# Altium project Infantry chassis pcb.PrjPcb
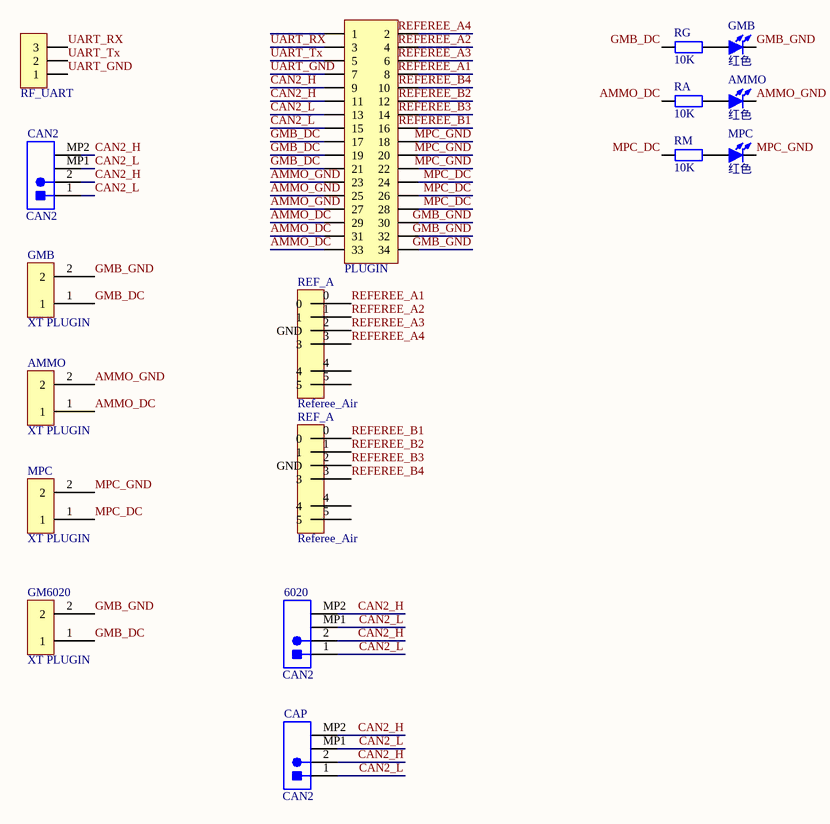
[diagram p0: schematic.SchDoc]
1 sheet, 17 parts. Net scope: global (net labels, ports and power ports of the same name join across sheets).
Board file: infantry chassis pcb.PcbDoc

## Sheet schematic.SchDoc
size A4

### Parts
(Parts that share a designator on the sheet are numbered #1, #2 ... from top to bottom, then left to right.)
6020  CAN2  [JST-BM02B-GHS-TBT_V]
AMMO#1  红色  [LED 0805G]
AMMO#2  XT PLUGIN  [XT30-M]
CAN2  CAN2  [JST-BM02B-GHS-TBT_V]
CAP  CAN2  [JST-BM02B-GHS-TBT_V]
GM6020  XT PLUGIN  [XT30-M]
GMB#1  红色  [LED 0805G]
GMB#2  XT PLUGIN  [XT30-M]
MPC#1  红色  [LED 0805G]
MPC#2  XT PLUGIN  [XT30-M]
PLUGIN  Header 2X11  [IDC2.54-LI-2x17P]  (value not drawn)
RA  10K  [R 0805_L]
REF_A#1  Referee_Air  [M8 Connector]
REF_A#2  Referee_Air  [M8 Connector]
RF_UART  HDR-1X3  [HDR2.54-LI-3P]  (value not drawn)
RG  10K  [R 0805_L]
RM  10K  [R 0805_L]

### Nets
AMMO_DC: AMMO#2.1 PLUGIN.29 PLUGIN.31 PLUGIN.33 RA.1
AMMO_GND: AMMO#1.2(K) AMMO#2.2 PLUGIN.23 PLUGIN.25 PLUGIN.27
CAN2_H: 6020.2 6020.MP2 CAN2.2 CAN2.MP2 CAP.2 CAP.MP2 PLUGIN.9 PLUGIN.11
CAN2_L: 6020.1 6020.MP1 CAN2.1 CAN2.MP1 CAP.1 CAP.MP1 PLUGIN.13 PLUGIN.15
GMB_DC: GM6020.1 GMB#2.1 PLUGIN.17 PLUGIN.19 PLUGIN.21 RG.1
GMB_GND: GM6020.2 GMB#1.2(K) GMB#2.2 PLUGIN.30 PLUGIN.32 PLUGIN.34
MPC_DC: MPC#2.1 PLUGIN.24 PLUGIN.26 PLUGIN.28 RM.1
MPC_GND: MPC#1.2(K) MPC#2.2 PLUGIN.18 PLUGIN.20 PLUGIN.22
REFEREE_A1: PLUGIN.8 REF_A#1.0
REFEREE_A2: PLUGIN.4 REF_A#1.1
REFEREE_A3: PLUGIN.6 REF_A#1.2(GND)
REFEREE_A4: PLUGIN.2 REF_A#1.3
REFEREE_B1: PLUGIN.16 REF_A#2.0
REFEREE_B2: PLUGIN.12 REF_A#2.1
REFEREE_B3: PLUGIN.14 REF_A#2.2(GND)
REFEREE_B4: PLUGIN.10 REF_A#2.3
UART_GND: PLUGIN.7 RF_UART.1
UART_RX: PLUGIN.3 RF_UART.3
UART_Tx: PLUGIN.5 RF_UART.2
NetAMMO#1_1: AMMO#1.1(A) RA.2
NetGMB#1_1: GMB#1.1(A) RG.2
NetMPC#1_1: MPC#1.1(A) RM.2

Not connected (* = marked no-connect by the designer): PLUGIN 1; REF_A#1 4 5; REF_A#2 4 5

### Library data of the parts
6020 CAN2 CAP = CMP-2000-05957-1: Disconnectable Crimp Style Connector, Pitch 1.25 mm, 1 x 2 Position, Height 4.05 mm, -25 to 85 degC, RoHS, Tape and Reel; Manufacturer: JST-Sales-America-Inc.; Connector Type: Header,Shrouded; Number of Positions Loaded: All; Pitch: 0.049"(1.25mm); Number of Positions: 2; Family: RectangularConnectors-Headers,MalePins; Contact Finish: Tin; Contact Type: OuterShroudContact; Number of Rows: 1; Row Spacing: -; Datasheet Version: 05/2016; Fastening Type: LockingRamp; Contact Mating Length: -; Packaging: Digi-Reel®; Manufacturer URL: http://www.jst.com/home2.html; Termination: Solder; Package Description: Disconnectable Crimp Style Connector, Pitch 1.25 mm, 1 x 2 Position, Height 4.05 mm; Features: SolderRetention; Color: Natural; Datasheet URL: http://www.jst-mfg.com/product/pdf/eng/eGH.pdf; Package Reference: BM02B-GHS-TBT; Series: GH; Contact Finish Thickness: -; Mounting Type: SurfaceMount; Mounting Technology: SurfaceMount; Category: Connectors,Interconnects
AMMO#1 GMB#1 MPC#1 = LED-SMD: 贴片LED; 版权归属: 封装库来自淘宝 ID：黄晶宝石; BOM名称: 贴片LED; 学习资源: https://shop463601444.taobao.com
PLUGIN = Header 17X2: 17*2P接插件; 版权归属: 封装库来自淘宝 ID：黄晶宝石; BOM名称: 17*2P接插件; 学习资源: https://shop463601444.taobao.com
RA RG RM = R: 贴片电阻; 版权归属: 来自淘宝 ID：黄晶宝石; 封装库来自淘宝卖家 ID：黄晶宝石: 其他店铺购入均为盗版，不享受售后技术支持服务，请立即申请退款; BOM名称: 贴片电阻; 联系售后: https://shop463601444.taobao.com
RF_UART = Header 3: 3P接插件; 版权归属: 封装库来自淘宝 ID：黄晶宝石; BOM名称: 3P接插件; 学习资源: https://shop463601444.taobao.com